# EAGLE schematic drums (EAGLE 7.2.0)
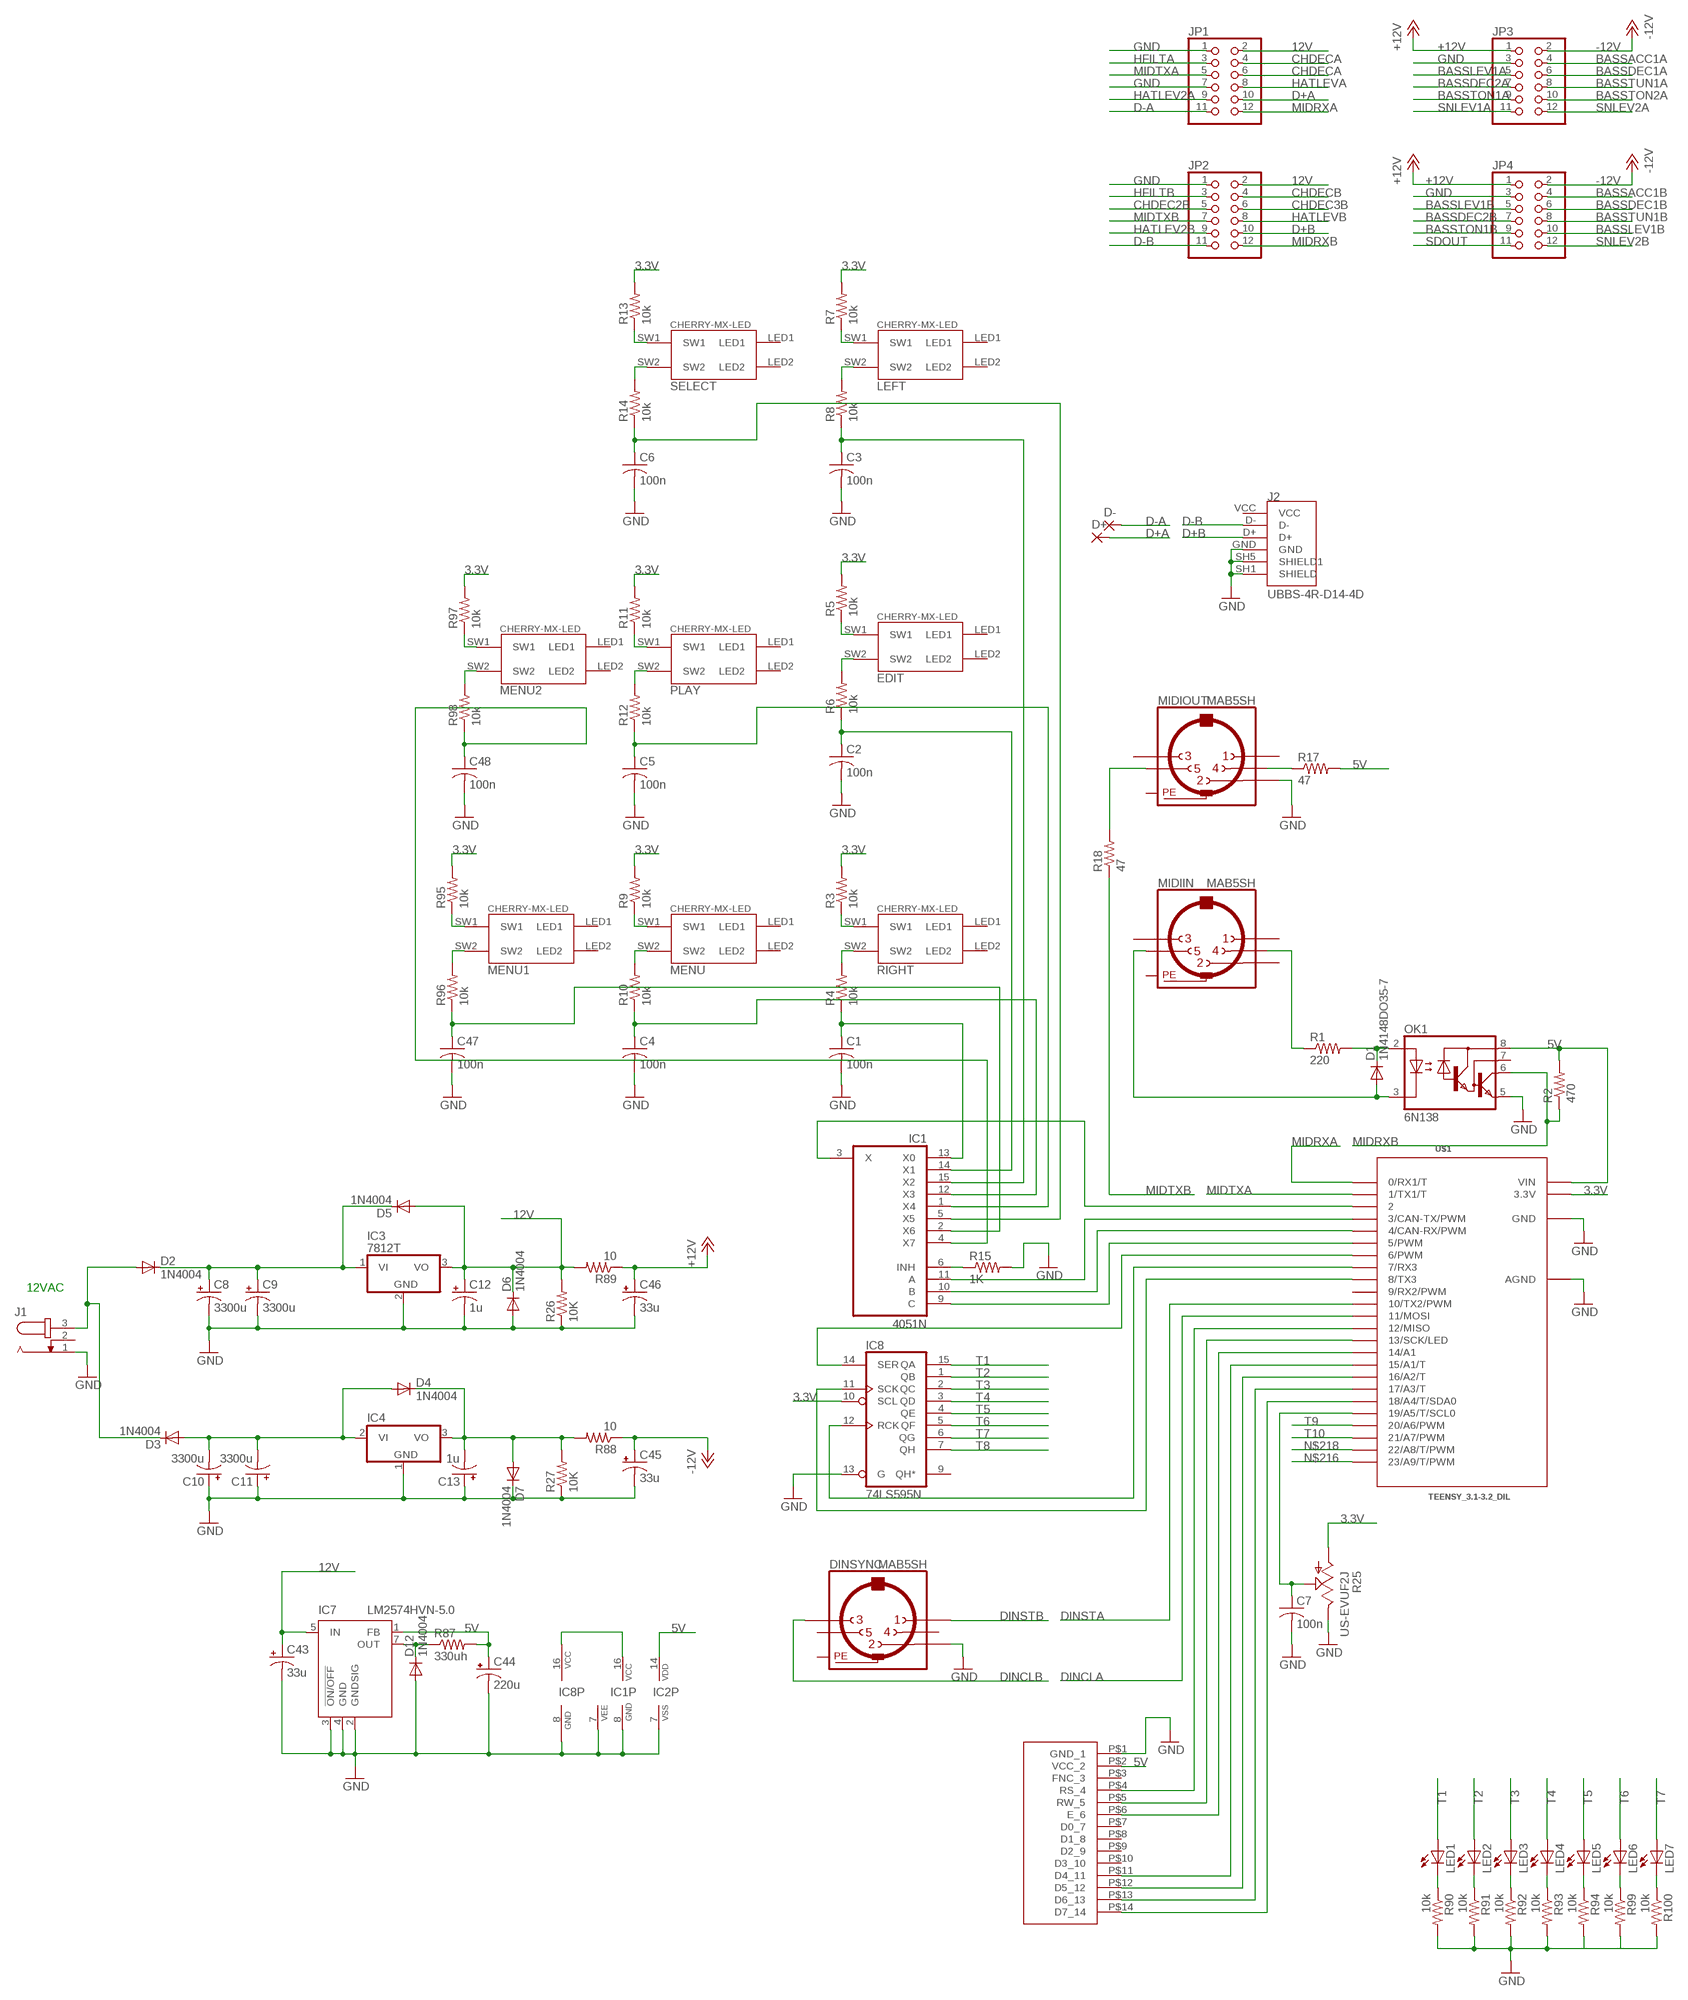
[diagram p0: schematic, sheet 1, part 1 of 2]
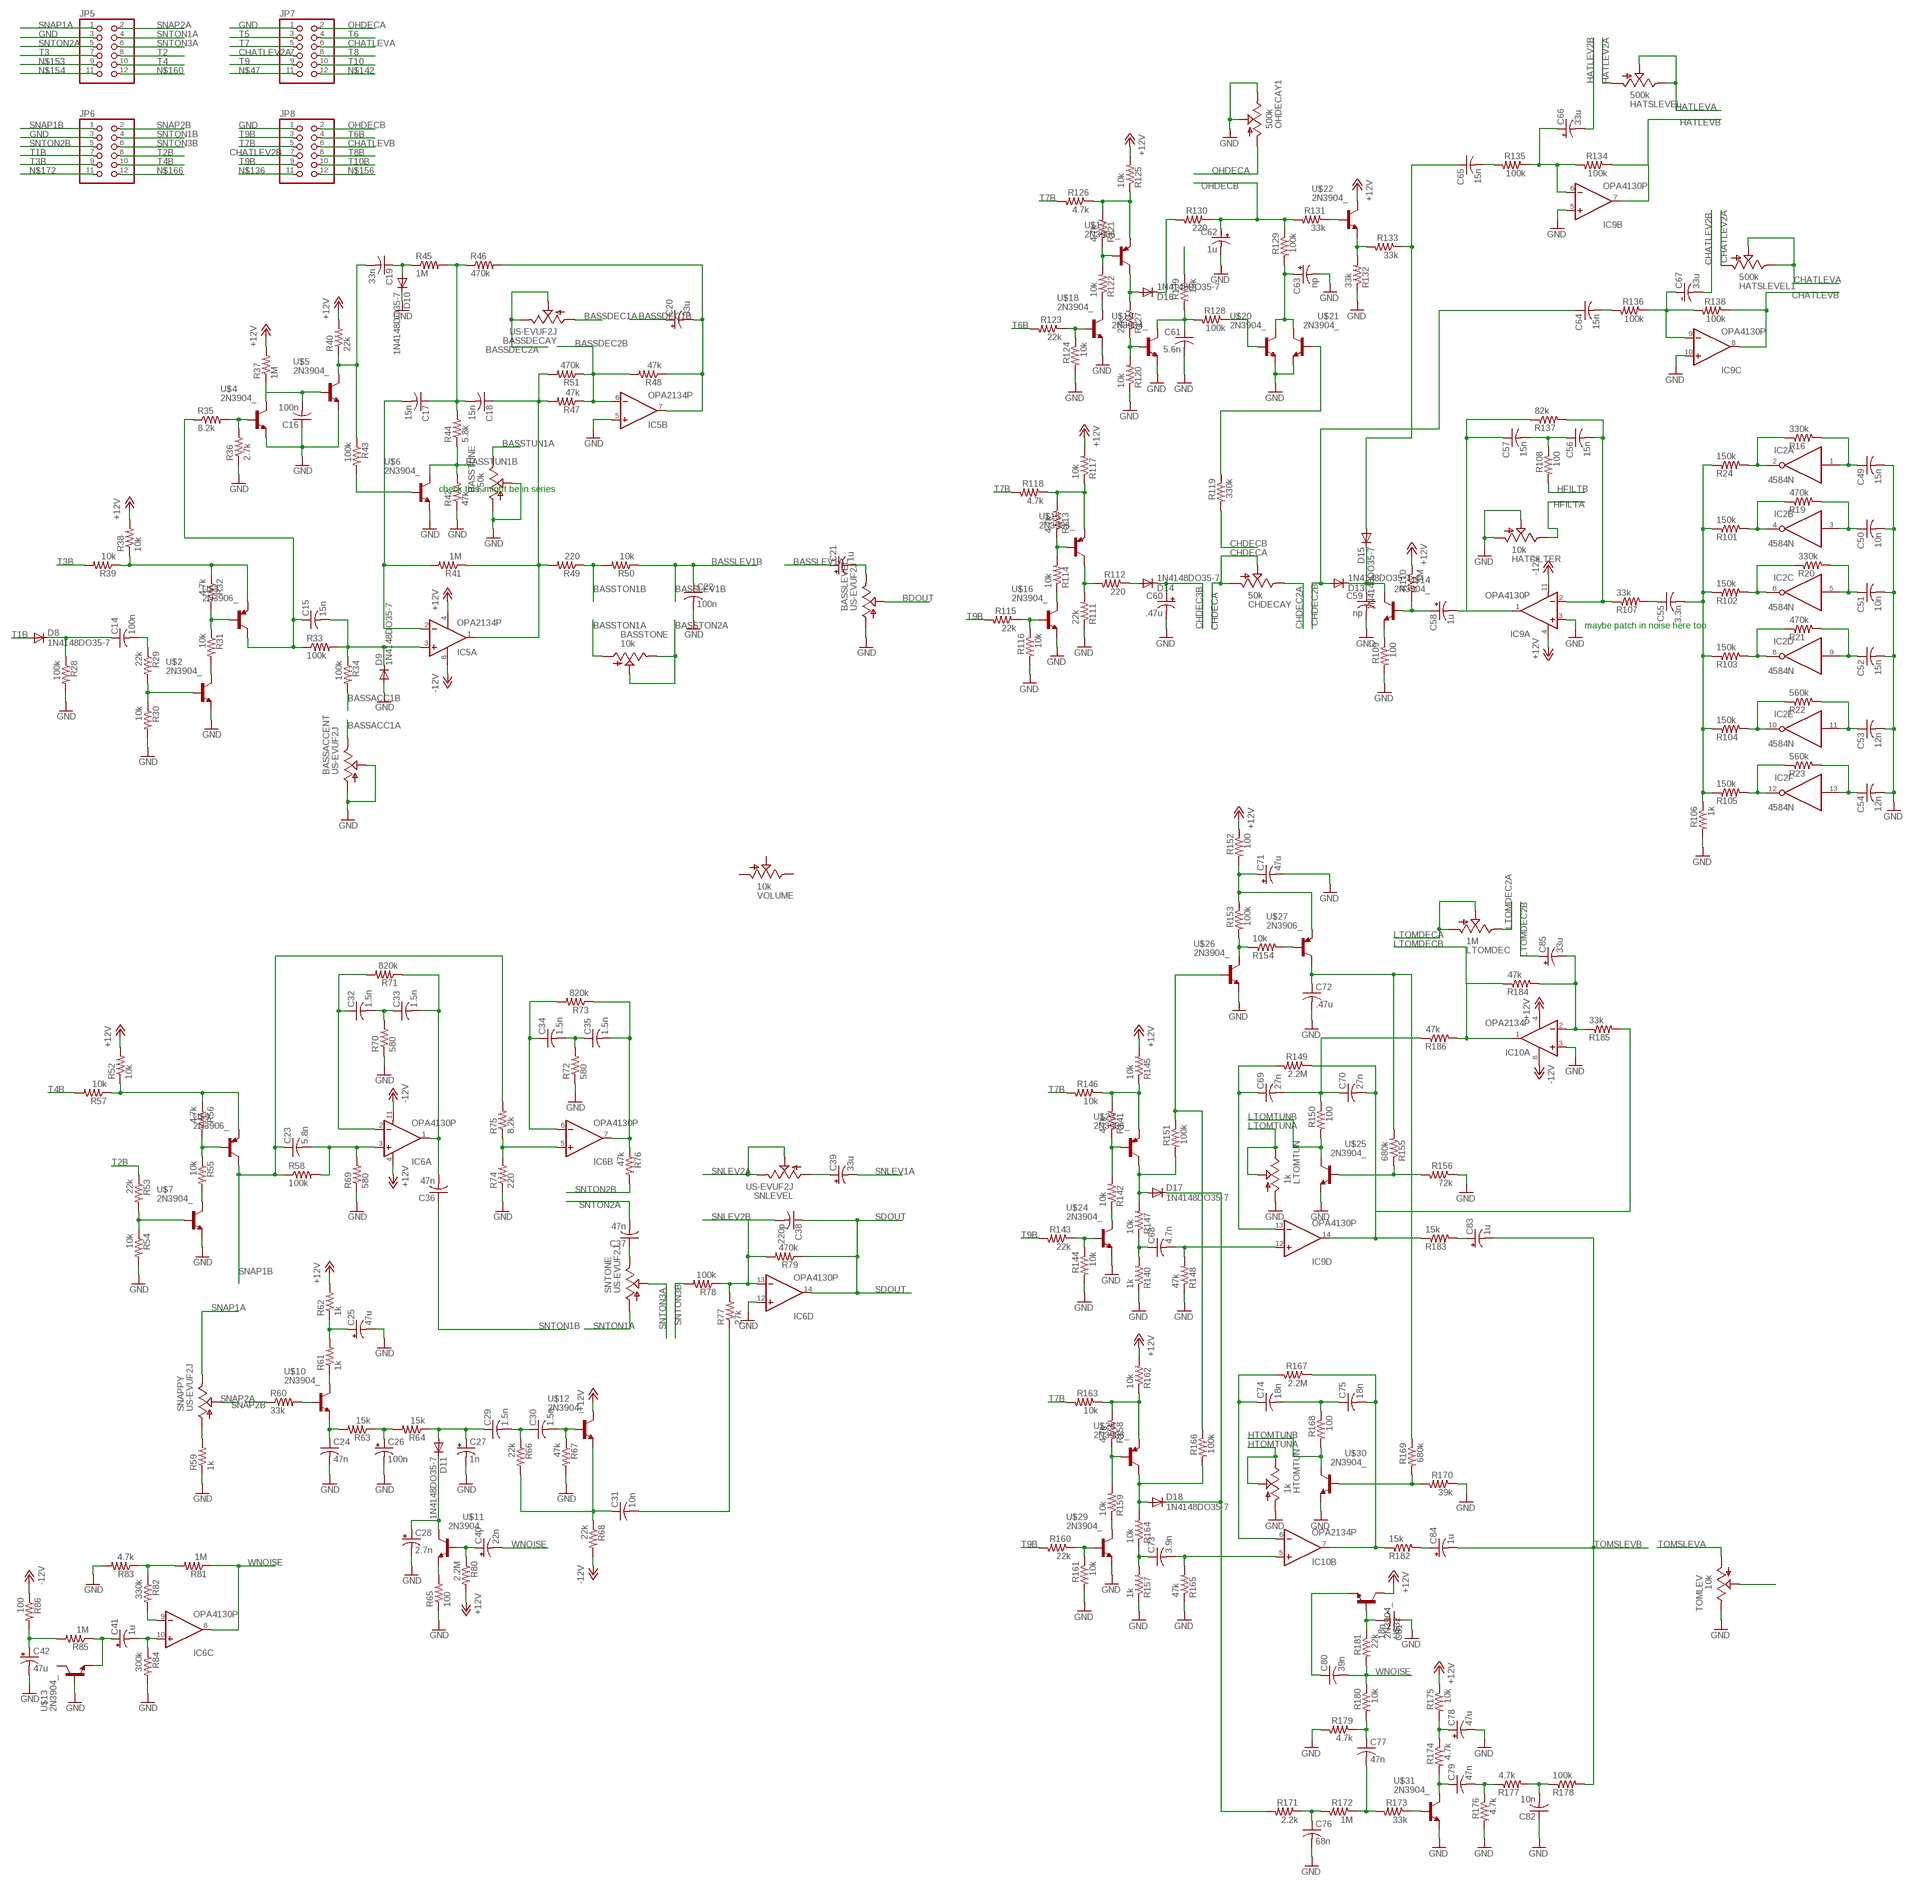
[diagram p1: schematic, sheet 1, part 2 of 2]

## Parts
BASSACCENT  US-EVUF2J  [EVUFXJ]
BASSDECAY  US-EVUF2J  [EVUFXJ]
BASSLEVEL  US-EVUF2J  [EVUFXJ]
BASSTONE  10k  US-EVUF2J  [EVUFXJ]
BASSTUNE  250k  US-EVUF2J  [EVUFXJ]
C1  100n  C-US050-025X075  [C050-025X075]
C2  100n  C-US050-025X075  [C050-025X075]
C3  100n  C-US050-025X075  [C050-025X075]
C4  100n  C-US050-025X075  [C050-025X075]
C5  100n  C-US050-025X075  [C050-025X075]
C6  100n  C-US050-025X075  [C050-025X075]
C7  100n  C-US050-025X075  [C050-025X075]
C8  3300u  CPOL-USE5-10.5  [E5-10,5]
C9  3300u  CPOL-USE5-10.5  [E5-10,5]
C10  3300u  CPOL-USE5-10.5  [E5-10,5]
C11  3300u  CPOL-USE5-10.5  [E5-10,5]
C12  1u  CPOL-USE2-5  [E2-5]
C13  1u  CPOL-USE2-5  [E2-5]
C14  100n  C-US050-025X075  [C050-025X075]
C15  15n  C-US050-025X075  [C050-025X075]
C16  100n  C-US050-025X075  [C050-025X075]
C17  15n  C-US050-025X075  [C050-025X075]
C18  15n  C-US050-025X075  [C050-025X075]
C19  33n  C-US050-025X075  [C050-025X075]
C20  33u  CPOL-USE2-5  [E2-5]
C21  1u  CPOL-USE2-5  [E2-5]
C22  100n  C-US050-025X075  [C050-025X075]
C23  5.8n  C-US050-025X075  [C050-025X075]
C24  47n  C-US050-025X075  [C050-025X075]
C25  47u  CPOL-USE2-5  [E2-5]
C26  100n  CPOL-USE2-5  [E2-5]
C27  1n  CPOL-USE2-5  [E2-5]
C28  2.7n  CPOL-USE2-5  [E2-5]
C29  1.5n  C-US050-025X075  [C050-025X075]
C30  1.5n  C-US050-025X075  [C050-025X075]
C31  10n  C-US050-025X075  [C050-025X075]
C32  1.5n  C-US050-025X075  [C050-025X075]
C33  1.5n  C-US050-025X075  [C050-025X075]
C34  1.5n  C-US050-025X075  [C050-025X075]
C35  1.5n  C-US050-025X075  [C050-025X075]
C36  47n  C-US050-025X075  [C050-025X075]
C37  47n  C-US050-025X075  [C050-025X075]
C38  220p  C-US050-025X075  [C050-025X075]
C39  33u  CPOL-USE2-5  [E2-5]
C40  22n  CPOL-USE2-5  [E2-5]
C41  1u  CPOL-USE2-5  [E2-5]
C42  47u  CPOL-USE2-5  [E2-5]
C43  33u  CPOL-USE2-5  [E2-5]
C44  220u  CPOL-USE2-5  [E2-5]
C45  33u  CPOL-USE2-5  [E2-5]
C46  33u  CPOL-USE2-5  [E2-5]
C47  100n  C-US050-025X075  [C050-025X075]
C48  100n  C-US050-025X075  [C050-025X075]
C49  15n  C-US050-025X075  [C050-025X075]
C50  10n  C-US050-025X075  [C050-025X075]
C51  10n  C-US050-025X075  [C050-025X075]
C52  15n  C-US050-025X075  [C050-025X075]
C53  12n  C-US050-025X075  [C050-025X075]
C54  12n  C-US050-025X075  [C050-025X075]
C55  3.3n  C-US050-025X075  [C050-025X075]
C56  15n  C-US050-025X075  [C050-025X075]
C57  15n  C-US050-025X075  [C050-025X075]
C58  1u  CPOL-USE2-5  [E2-5]
C59  np  C-US050-025X075  [C050-025X075]
C60  .47u  CPOL-USE2-5  [E2-5]
C61  5.6n  C-US050-025X075  [C050-025X075]
C62  1u  CPOL-USE2-5  [E2-5]
C63  np  CPOL-USE2-5  [E2-5]
C64  15n  C-US050-025X075  [C050-025X075]
C65  15n  C-US050-025X075  [C050-025X075]
C66  33u  CPOL-USE2-5  [E2-5]
C67  33u  CPOL-USE2-5  [E2-5]
C68  4.7n  C-US050-025X075  [C050-025X075]
C69  27n  C-US050-025X075  [C050-025X075]
C70  27n  C-US050-025X075  [C050-025X075]
C71  47u  CPOL-USE2-5  [E2-5]
C72  .47u  C-US050-025X075  [C050-025X075]
C73  3.9n  C-US050-025X075  [C050-025X075]
C74  18n  C-US050-025X075  [C050-025X075]
C75  18n  C-US050-025X075  [C050-025X075]
C76  68n  C-US050-025X075  [C050-025X075]
C77  47n  C-US050-025X075  [C050-025X075]
C78  47u  CPOL-USE2-5  [E2-5]
C79  47n  C-US050-025X075  [C050-025X075]
C80  39n  C-US050-025X075  [C050-025X075]
C81  18n  C-US050-025X075  [C050-025X075]
C82  10n  C-US050-025X075  [C050-025X075]
C83  1u  CPOL-USE2-5  [E2-5]
C84  1u  CPOL-USE2-5  [E2-5]
C85  33u  CPOL-USE2-5  [E2-5]
CHDECAY  50k  US-EVUF2J  [EVUFXJ]
D1  1N4148DO35-7  [DO35-7]
D2  1N4004  [DO41-10]
D3  1N4004  [DO41-10]
D4  1N4004  [DO41-10]
D5  1N4004  [DO41-10]
D6  1N4004  [DO41-10]
D7  1N4004  [DO41-10]
D8  1N4148DO35-7  [DO35-7]
D9  1N4148DO35-7  [DO35-7]
D10  1N4148DO35-7  [DO35-7]
D11  1N4148DO35-7  [DO35-7]
D12  1N4004  [DO41-10]
D13  1N4148DO35-7  [DO35-7]
D14  1N4148DO35-7  [DO35-7]
D15  1N4148DO35-7  [DO35-7]
D16  1N4148DO35-7  [DO35-7]
D17  1N4148DO35-7  [DO35-7]
D18  1N4148DO35-7  [DO35-7]
D+  2,0/0,9-R  [2,0/0,9-R]
D-  2,0/0,9-R  [2,0/0,9-R]
DINSYNC  MAB5SH  [MAB5SH]
EDIT  CHERRY-MX-LED  [CHERRY-MX-LED]
HATFILTER  10k  US-EVUF2J  [EVUFXJ]
HATSLEVEL  500k  US-EVUF2J  [EVUFXJ]
HATSLEVEL1  500k  US-EVUF2J  [EVUFXJ]
HTOMTUN  1k  US-EVUF2J  [EVUFXJ]
IC1  4051N  [DIL16]
IC2  4584N  [DIL14]
IC3  7812T  [TO220H]
IC4  7906T  [TO220H]
IC5  OPA2134P  [DIL08]
IC6  OPA4130P  [DIL14]
IC7  LM2574HVN-5.0  [DIL08]
IC8  74LS595N  [DIL16]
IC9  OPA4130P  [DIL14]
IC10  OPA2134P  [DIL08]
J1  JACK-PLUG0  [SPC4077]
J2  UBBS-4R-D14-4D  [JST_UBBS-4R-D14-4D]
JP1  PINHD-2X6  [2X06]
JP2  PINHD-2X6  [2X06]
JP3  PINHD-2X6  [2X06]
JP4  PINHD-2X6  [2X06]
JP5  PINHD-2X6  [2X06]
JP6  PINHD-2X6  [2X06]
JP7  PINHD-2X6  [2X06]
JP8  PINHD-2X6  [2X06]
LED1  LED5MM  [LED5MM]
LED2  LED5MM  [LED5MM]
LED3  LED5MM  [LED5MM]
LED4  LED5MM  [LED5MM]
LED5  LED5MM  [LED5MM]
LED6  LED5MM  [LED5MM]
LED7  LED5MM  [LED5MM]
LEFT  CHERRY-MX-LED  [CHERRY-MX-LED]
LTOMDEC  1M  US-EVUF2J  [EVUFXJ]
LTOMTUN  1k  US-EVUF2J  [EVUFXJ]
MENU  CHERRY-MX-LED  [CHERRY-MX-LED]
MENU1  CHERRY-MX-LED  [CHERRY-MX-LED]
MENU2  CHERRY-MX-LED  [CHERRY-MX-LED]
MIDIIN  MAB5SH  [MAB5SH]
MIDIOUT  MAB5SH  [MAB5SH]
OHDECAY1  500k  US-EVUF2J  [EVUFXJ]
OK1  6N138  [DIL08]
PLAY  CHERRY-MX-LED  [CHERRY-MX-LED]
R1  220  R-US_0207/2V  [0207/2V]
R2  470  R-US_0207/2V  [0207/2V]
R3  10k  R-US_0207/2V  [0207/2V]
R4  10k  R-US_0207/2V  [0207/2V]
R5  10k  R-US_0207/2V  [0207/2V]
R6  10k  R-US_0207/2V  [0207/2V]
R7  10k  R-US_0207/2V  [0207/2V]
R8  10k  R-US_0207/2V  [0207/2V]
R9  10k  R-US_0207/2V  [0207/2V]
R10  10k  R-US_0207/2V  [0207/2V]
R11  10k  R-US_0207/2V  [0207/2V]
R12  10k  R-US_0207/2V  [0207/2V]
R13  10k  R-US_0207/2V  [0207/2V]
R14  10k  R-US_0207/2V  [0207/2V]
R15  1K  R-US_0207/2V  [0207/2V]
R16  330k  R-US_0207/2V  [0207/2V]
R17  47  R-US_0207/2V  [0207/2V]
R18  47  R-US_0207/2V  [0207/2V]
R19  470k  R-US_0207/2V  [0207/2V]
R20  330k  R-US_0207/2V  [0207/2V]
R21  470k  R-US_0207/2V  [0207/2V]
R22  560k  R-US_0207/2V  [0207/2V]
R23  560k  R-US_0207/2V  [0207/2V]
R24  150k  R-US_0207/2V  [0207/2V]
R25  US-EVUF2J  [EVUFXJ]
R26  10K  R-US_0207/7  [0207/7]
R27  10K  R-US_0207/7  [0207/7]
R28  100k  R-US_0207/2V  [0207/2V]
R29  22k  R-US_0207/2V  [0207/2V]
R30  10k  R-US_0207/2V  [0207/2V]
R31  10k  R-US_0207/2V  [0207/2V]
R32  4.7k  R-US_0207/2V  [0207/2V]
R33  100k  R-US_0207/2V  [0207/2V]
R34  100k  R-US_0207/2V  [0207/2V]
R35  8.2k  R-US_0207/2V  [0207/2V]
R36  2.7k  R-US_0207/2V  [0207/2V]
R37  1M  R-US_0207/2V  [0207/2V]
R38  10k  R-US_0207/2V  [0207/2V]
R39  10k  R-US_0207/2V  [0207/2V]
R40  22k  R-US_0207/2V  [0207/2V]
R41  1M  R-US_0207/2V  [0207/2V]
R42  47k  R-US_0207/2V  [0207/2V]
R43  100k  R-US_0207/2V  [0207/2V]
R44  5.8k  R-US_0207/2V  [0207/2V]
R45  1M  R-US_0207/2V  [0207/2V]
R46  470k  R-US_0207/2V  [0207/2V]
R47  47k  R-US_0207/2V  [0207/2V]
R48  47k  R-US_0207/2V  [0207/2V]
R49  220  R-US_0207/2V  [0207/2V]
R50  10k  R-US_0207/2V  [0207/2V]
R51  470k  R-US_0207/2V  [0207/2V]
R52  10k  R-US_0207/2V  [0207/2V]
R53  22k  R-US_0207/2V  [0207/2V]
R54  10k  R-US_0207/2V  [0207/2V]
R55  10k  R-US_0207/2V  [0207/2V]
R56  4.7k  R-US_0207/2V  [0207/2V]
R57  10k  R-US_0207/2V  [0207/2V]
R58  100k  R-US_0207/2V  [0207/2V]
R59  1k  R-US_0207/2V  [0207/2V]
R60  33k  R-US_0207/2V  [0207/2V]
R61  1k  R-US_0207/2V  [0207/2V]
R62  1k  R-US_0207/2V  [0207/2V]
R63  15k  R-US_0207/2V  [0207/2V]
R64  15k  R-US_0207/2V  [0207/2V]
R65  100  R-US_0207/2V  [0207/2V]
R66  22k  R-US_0207/2V  [0207/2V]
R67  47k  R-US_0207/2V  [0207/2V]
R68  22k  R-US_0207/2V  [0207/2V]
R69  580  R-US_0207/2V  [0207/2V]
R70  580  R-US_0207/2V  [0207/2V]
R71  820k  R-US_0207/2V  [0207/2V]
R72  580  R-US_0207/2V  [0207/2V]
R73  820k  R-US_0207/2V  [0207/2V]
R74  220  R-US_0207/2V  [0207/2V]
R75  8.2k  R-US_0207/2V  [0207/2V]
R76  47k  R-US_0207/2V  [0207/2V]
R77  27k  R-US_0207/2V  [0207/2V]
R78  100k  R-US_0207/2V  [0207/2V]
R79  470k  R-US_0207/2V  [0207/2V]
R80  2.2M  R-US_0207/2V  [0207/2V]
R81  1M  R-US_0207/2V  [0207/2V]
R82  330k  R-US_0207/2V  [0207/2V]
R83  4.7k  R-US_0207/2V  [0207/2V]
R84  300k  R-US_0207/2V  [0207/2V]
R85  1M  R-US_0207/2V  [0207/2V]
R86  100  R-US_0207/2V  [0207/2V]
R87  330uh  R-US_0207/2V  [0207/2V]
R88  10  R-US_0207/7  [0207/7]
R89  10  R-US_0207/7  [0207/7]
R90  10k  R-US_0207/2V  [0207/2V]
R91  10k  R-US_0207/2V  [0207/2V]
R92  10k  R-US_0207/2V  [0207/2V]
R93  10k  R-US_0207/2V  [0207/2V]
R94  10k  R-US_0207/2V  [0207/2V]
R95  10k  R-US_0207/2V  [0207/2V]
R96  10k  R-US_0207/2V  [0207/2V]
R97  10k  R-US_0207/2V  [0207/2V]
R98  10k  R-US_0207/2V  [0207/2V]
R99  10k  R-US_0207/2V  [0207/2V]
R100  10k  R-US_0207/2V  [0207/2V]
R101  150k  R-US_0207/2V  [0207/2V]
R102  150k  R-US_0207/2V  [0207/2V]
R103  150k  R-US_0207/2V  [0207/2V]
R104  150k  R-US_0207/2V  [0207/2V]
R105  150k  R-US_0207/2V  [0207/2V]
R106  1k  R-US_0207/2V  [0207/2V]
R107  33k  R-US_0207/2V  [0207/2V]
R108  100  R-US_0207/2V  [0207/2V]
R109  100  R-US_0207/2V  [0207/2V]
R110  1M  R-US_0207/2V  [0207/2V]
R111  22k  R-US_0207/2V  [0207/2V]
R112  220  R-US_0207/2V  [0207/2V]
R113  4.7k  R-US_0207/2V  [0207/2V]
R114  10k  R-US_0207/2V  [0207/2V]
R115  22k  R-US_0207/2V  [0207/2V]
R116  10k  R-US_0207/2V  [0207/2V]
R117  10k  R-US_0207/2V  [0207/2V]
R118  4.7k  R-US_0207/2V  [0207/2V]
R119  330k  R-US_0207/2V  [0207/2V]
R120  10k  R-US_0207/2V  [0207/2V]
R121  4.7k  R-US_0207/2V  [0207/2V]
R122  10k  R-US_0207/2V  [0207/2V]
R123  22k  R-US_0207/2V  [0207/2V]
R124  10k  R-US_0207/2V  [0207/2V]
R125  10k  R-US_0207/2V  [0207/2V]
R126  4.7k  R-US_0207/2V  [0207/2V]
R127  22k  R-US_0207/2V  [0207/2V]
R128  100k  R-US_0207/2V  [0207/2V]
R129  100k  R-US_0207/2V  [0207/2V]
R130  220  R-US_0207/2V  [0207/2V]
R131  33k  R-US_0207/2V  [0207/2V]
R132  33k  R-US_0207/2V  [0207/2V]
R133  33k  R-US_0207/2V  [0207/2V]
R134  100k  R-US_0207/2V  [0207/2V]
R135  100k  R-US_0207/2V  [0207/2V]
R136  100k  R-US_0207/2V  [0207/2V]
R137  82k  R-US_0207/2V  [0207/2V]
R138  100k  R-US_0207/2V  [0207/2V]
R139  15k  R-US_0207/2V  [0207/2V]
R140  1k  R-US_0207/2V  [0207/2V]
R141  4.7k  R-US_0207/2V  [0207/2V]
R142  10k  R-US_0207/2V  [0207/2V]
R143  22k  R-US_0207/2V  [0207/2V]
R144  10k  R-US_0207/2V  [0207/2V]
R145  10k  R-US_0207/2V  [0207/2V]
R146  10k  R-US_0207/2V  [0207/2V]
R147  10k  R-US_0207/2V  [0207/2V]
R148  47k  R-US_0207/2V  [0207/2V]
R149  2.2M  R-US_0207/2V  [0207/2V]
R150  100  R-US_0207/2V  [0207/2V]
R151  100k  R-US_0207/2V  [0207/2V]
R152  100  R-US_0207/2V  [0207/2V]
R153  100k  R-US_0207/2V  [0207/2V]
R154  10k  R-US_0207/2V  [0207/2V]
R155  680k  R-US_0207/2V  [0207/2V]
R156  72k  R-US_0207/2V  [0207/2V]
R157  1k  R-US_0207/2V  [0207/2V]
R158  4.7k  R-US_0207/2V  [0207/2V]
R159  10k  R-US_0207/2V  [0207/2V]
R160  22k  R-US_0207/2V  [0207/2V]
R161  10k  R-US_0207/2V  [0207/2V]
R162  10k  R-US_0207/2V  [0207/2V]
R163  10k  R-US_0207/2V  [0207/2V]
R164  10k  R-US_0207/2V  [0207/2V]
R165  47k  R-US_0207/2V  [0207/2V]
R166  100k  R-US_0207/2V  [0207/2V]
R167  2.2M  R-US_0207/2V  [0207/2V]
R168  100  R-US_0207/2V  [0207/2V]
R169  680k  R-US_0207/2V  [0207/2V]
R170  39k  R-US_0207/2V  [0207/2V]
R171  2.2k  R-US_0207/2V  [0207/2V]
R172  1M  R-US_0207/2V  [0207/2V]
R173  33k  R-US_0207/2V  [0207/2V]
R174  4.7k  R-US_0207/2V  [0207/2V]
R175  10k  R-US_0207/2V  [0207/2V]
R176  4.7k  R-US_0207/2V  [0207/2V]
R177  4.7k  R-US_0207/2V  [0207/2V]
R178  100k  R-US_0207/2V  [0207/2V]
R179  4.7k  R-US_0207/2V  [0207/2V]
R180  10k  R-US_0207/2V  [0207/2V]
R181  22k  R-US_0207/2V  [0207/2V]
R182  15k  R-US_0207/2V  [0207/2V]
R183  15k  R-US_0207/2V  [0207/2V]
R184  47k  R-US_0207/2V  [0207/2V]
R185  33k  R-US_0207/2V  [0207/2V]
R186  47k  R-US_0207/2V  [0207/2V]
RIGHT  CHERRY-MX-LED  [CHERRY-MX-LED]
SELECT  CHERRY-MX-LED  [CHERRY-MX-LED]
SNAPPY  US-EVUF2J  [EVUFXJ]
SNLEVEL  US-EVUF2J  [EVUFXJ]
SNTONE  US-EVUF2J  [EVUFXJ]
TOMLEV  10k  US-EVUF2J  [EVUFXJ]
U$1  TEENSY_3.1-3.2_DIL  [TEENSY_3.0-3.2&LC_DIL]
U$2  2N3904_  [TO92-EBC]
U$3  2N3906_  [TO92-EBC]
U$4  2N3904_  [TO92-EBC]
U$5  2N3904_  [TO92-EBC]
U$6  2N3904_  [TO92-EBC]
U$7  2N3904_  [TO92-EBC]
U$8  CU20045-UW  [CU20045-UW]
U$9  2N3906_  [TO92-EBC]
U$10  2N3904_  [TO92-EBC]
U$11  2N3904_  [TO92-EBC]
U$12  2N3904_  [TO92-EBC]
U$13  2N3904_  [TO92-EBC]
U$14  2N3904_  [TO92-EBC]
U$15  2N3906_  [TO92-EBC]
U$16  2N3904_  [TO92-EBC]
U$17  2N3906_  [TO92-EBC]
U$18  2N3904_  [TO92-EBC]
U$19  2N3904_  [TO92-EBC]
U$20  2N3904_  [TO92-EBC]
U$21  2N3904_  [TO92-EBC]
U$22  2N3904_  [TO92-EBC]
U$23  2N3906_  [TO92-EBC]
U$24  2N3904_  [TO92-EBC]
U$25  2N3904_  [TO92-EBC]
U$26  2N3904_  [TO92-EBC]
U$27  2N3906_  [TO92-EBC]
U$28  2N3906_  [TO92-EBC]
U$29  2N3904_  [TO92-EBC]
U$30  2N3904_  [TO92-EBC]
U$31  2N3904_  [TO92-EBC]
U$32  2N3904_  [TO92-EBC]
VOLUME  10k  US-EVUF2J  [EVUFXJ]

## Nets
3.3V: IC1.16(VCC) IC8.10(SCL) IC8.16(VCC) R3.2 R5.2 R7.2 R9.2 R11.2 R13.2 R25.1(A) R95.2 R97.2 U$1.3.3V
5V: C44.+ IC2.14(P:VDD) IC7.1(FB) OK1.8(VCC) R2.2 R17.2 R87.2 U$1.VIN U$8.P$2(VCC_2)
12V: C12.+ C43.+ D5.A D6.C IC3.3(VO) IC7.5(IN) JP1.2 JP2.2 R26.2 R89.2
+12V: C46.+ IC5.4(P:V-) IC6.4(A:V+) IC9.4(A:V+) IC10.4(P:V-) JP3.1 JP4.1 R37.2 R38.2 R40.2 R52.2 R62.2 R80.2 R89.1 R110.1 R117.2 R125.2 R145.2 R152.1 R162.2 R175.1 U$12.E(C) U$22.E(C) U$32.E(C)
-12V: C45.+ IC5.8(P:V+) IC6.11(A:V-) IC9.11(A:V-) IC10.8(P:V+) JP3.2 JP4.2 R68.2 R86.1 R88.1
BASSACC1A: BASSACCENT.3(E) JP3.4
BASSACC1B: JP4.4 R34.2
BASSDEC1A: BASSDECAY.1(A) JP3.6
BASSDEC1B: C20.+ JP4.6
BASSDEC2A: BASSDECAY.2(S) BASSDECAY.3(E) JP3.7
BASSDEC2B: IC5.6(B:-IN) JP4.7 R47.1 R48.2 R51.1
BASSLEV1A: C21.+ JP3.5
BASSLEV1B: C22.1 JP4.5 JP4.10 R50.1
BASSTON1A: BASSTONE.1(A) JP3.9
BASSTON1B: JP4.9 R49.1 R50.2
BASSTON2A: BASSTONE.2(S) BASSTONE.3(E) JP3.10
BASSTUN1A: BASSTUNE.3(E) JP3.8
BASSTUN1B: JP4.8 R42.2 R44.1 U$6.E(C)
BDOUT: BASSLEVEL.2(S)
CHATLEV2A: HATSLEVEL1.1(A) JP7.7
CHATLEV2B: C67.- JP8.7
CHATLEVA: HATSLEVEL1.2(S) HATSLEVEL1.3(E) JP7.6
CHATLEVB: IC9.8(C:OUT) JP8.6 R138.1
CHDEC2A: CHDECAY.3(E)
CHDEC2B: C64.1 D13.A JP2.5
CHDEC3B: C60.+ D14.C JP2.6
CHDECA: CHDECAY.1(A) CHDECAY.2(S) JP1.4 JP1.6
CHDECB: JP2.4 R119.2
D+A: D+.1(P) JP1.10
D+B: J2.D+ JP2.10
D-A: D-.1(P) JP1.11
D-B: J2.D- JP2.11
DINCLA: U$1.11(11/MOSI)
DINCLB: DINSYNC.3
DINSTA: U$1.10(10/TX2/PWM)
DINSTB: DINSYNC.1
GND: BASSACCENT.1(A) BASSACCENT.2(S) BASSLEVEL.1(A) BASSTUNE.1(A) BASSTUNE.2(S) C1.2 C2.2 C3.2 C4.2 C5.2 C6.2 C7.2 C8.- C9.- C10.+ C11.+ C12.- C13.+ C16.1 C22.2 C24.2 C25.- C26.- C27.- C28.- C42.- C43.- C44.- C45.- C46.- C47.2 C48.2 C49.2 C50.2 C51.2 C52.2 C53.2 C54.2 C59.2 C60.- C61.2 C62.- C63.- C71.- C72.2 C76.2 C78.- C81.1 C82.1 D6.A D7.C D9.A D10.C D12.A DINSYNC.2 HATFILTER.1(A) HATFILTER.2(S) HTOMTUN.1(A) IC1.7(VEE) IC1.8(GND) IC2.7(P:VSS) IC3.2(GND) IC4.1(GND) IC5.5(B:+IN) IC6.12(D:+IN) IC7.2(GNDSIG) IC7.3(!ON/OFF) IC7.4(GND) IC8.8(GND) IC8.13(G) IC9.3(A:+IN) IC9.5(B:+IN) IC9.10(C:+IN) IC10.3(A:+IN) J1.1 J2.GND J2.SH1(SHIELD) J2.SH5(SHIELD1) JP1.1 JP1.7 JP2.1 JP3.3 JP4.3 JP5.3 JP6.3 JP7.1 JP8.1 LTOMTUN.1(A) MIDIOUT.2 OHDECAY1.2(S) OHDECAY1.3(E) OK1.5(GND) R15.2 R25.3(E) R26.1 R27.1 R28.2 R30.2 R36.1 R42.1 R54.2 R59.1 R65.1 R67.2 R69.1 R70.1 R72.1 R74.1 R83.2 R84.2 R90.2 R91.2 R92.2 R93.2 R94.2 R106.2 R109.2 R111.1 R116.2 R120.1 R124.2 R132.1 R140.1 R144.2 R148.1 R156.1 R157.1 R161.2 R165.1 R170.1 R176.2 R179.2 TOMLEV.3(E) U$1.AGND U$1.GND U$2.C(E) U$4.C(E) U$5.C(E) U$6.C(E) U$7.C(E) U$8.P$1(GND_1) U$13.B U$16.C(E) U$18.C(E) U$19.C(E) U$20.C(E) U$21.C(E) U$24.C(E) U$25.C(E) U$26.C(E) U$29.C(E) U$30.C(E) U$31.C(E)
GND1: R99.2
GND2: R100.2
HATLEV2A: HATSLEVEL.1(A) JP1.9
HATLEV2B: C66.- JP2.9
HATLEVA: HATSLEVEL.2(S) HATSLEVEL.3(E) JP1.8
HATLEVB: IC9.7(B:OUT) JP2.8 R134.1
HFILTA: HATFILTER.3(E) JP1.3
HFILTB: JP2.3 R108.2
HTOMTUNA: HTOMTUN.2(S) HTOMTUN.3(E)
HTOMTUNB: R168.2 U$30.E(C)
LTOMDEC2A: LTOMDEC.3(E)
LTOMDEC2B: C85.+
LTOMDECA: LTOMDEC.1(A) LTOMDEC.2(S)
LTOMDECB: IC10.1(A:OUT) R184.1 R186.2
LTOMTUNA: LTOMTUN.2(S) LTOMTUN.3(E)
LTOMTUNB: R150.2 U$25.E(C)
MIDRXA: JP1.12 U$1.0(0/RX1/T)
MIDRXB: JP2.12 OK1.6(VO) R2.1
MIDTXA: JP1.5 U$1.1(1/TX1/T)
MIDTXB: JP2.7 R18.1
N$1: R4.2 RIGHT.SW2
N$2: C67.+ IC9.9(C:-IN) R136.1 R138.2
N$3: C1.1 IC1.13(X0) R4.1
N$4: D1.C OK1.2(A) R1.2
N$5: D1.A MIDIIN.5 OK1.3(C)
N$6: EDIT.SW1 R5.1
N$7: IC1.3(X) U$1.2
N$8: IC1.11(A) U$1.3(3/CAN-TX/PWM)
N$9: IC1.10(B) U$1.4(4/CAN-RX/PWM)
N$10: IC1.9(C) U$1.5(5/PWM)
N$11: R3.1 RIGHT.SW1
N$12: EDIT.SW2 R6.2
N$13: C2.1 IC1.14(X1) R6.1
N$14: LEFT.SW1 R7.1
N$15: LEFT.SW2 R8.2
N$16: C3.1 IC1.15(X2) R8.1
N$17: MENU.SW1 R9.1
N$18: MENU.SW2 R10.2
N$19: C4.1 IC1.12(X3) R10.1
N$20: PLAY.SW1 R11.1
N$21: PLAY.SW2 R12.2
N$22: C5.1 IC1.1(X4) R12.1
N$23: R13.1 SELECT.SW1
N$24: R14.2 SELECT.SW2
N$25: C6.1 IC1.5(X5) R14.1
N$26: MIDIIN.4 R1.1
N$27: IC1.6(INH) R15.1
N$28: IC8.12(RCK) U$1.7(7/RX3)
N$29: IC8.14(SER) U$1.6(6/PWM)
N$30: IC8.11(SCK) U$1.8(8/TX3)
N$31: C52.1 IC2.9(D:I) R21.2
N$32: R139.1
N$33: MIDIOUT.4 R17.1
N$34: MIDIOUT.5 R18.2
N$35: D17.A R147.2 R151.2 U$23.E(C)
N$36: R141.1 R142.2 U$23.B
N$37: R141.2 R145.1 R146.1 U$23.C(E)
N$38: R142.1 U$24.E(C)
N$40: U$1.12(12/MISO) U$8.P$4(RS_4)
N$41: U$1.13(13/SCK/LED) U$8.P$5(RW_5)
N$42: U$1.14/A0(14/A1) U$8.P$6(E_6)
N$43: U$1.15/A1(15/A1/T) U$8.P$11(D4_11)
N$44: U$1.16/A2(16/A2/T) U$8.P$12(D5_12)
N$45: U$1.17/A3(17/A3/T) U$8.P$13(D6_13)
N$46: U$1.18/A4(18/A4/T/SDA0) U$8.P$14(D7_14)
N$47: JP7.11
N$48: R143.1 R144.1 U$24.B
N$49: IC2.8(D:O) R21.1 R103.2
N$50: C68.1 R140.2 R147.1
N$51: C7.1 R25.2(S) U$1.19/A5(19/A5/T/SCL0)
N$52: C8.+ C9.+ D2.C D5.C IC3.1(VI)
N$53: C10.- C11.- D3.A D4.A IC4.2(VI)
N$54: D2.A D3.C J1.3
N$55: C14.1 D8.C R28.1
N$56: C14.2 R29.1
N$57: R29.2 R30.1 U$2.B
N$58: R31.2 U$2.E(C)
N$59: R31.1 R32.2 U$3.B
N$60: R32.1 R38.1 R39.1 U$3.C(E)
N$61: C15.1 R33.1 R35.1 U$3.E(C)
N$62: C17.2 IC5.2(A:-IN) R41.2
N$63: C15.2 D9.C IC5.3(A:+IN) R33.2 R34.1
N$64: C19.2 R40.1 R43.1 U$5.E(C)
N$65: C18.1 IC5.1(A:OUT) R41.1 R47.2 R49.2 R51.2
N$66: R35.2 R36.2 U$4.B
N$67: IC2.2(A:O) R16.1 R24.2
N$68: C16.2 R37.1 U$4.E(C) U$5.B
N$69: C23.2 IC6.3(A:+IN) R58.2 R69.2
N$70: R43.2 U$6.B
N$71: C49.1 IC2.1(A:I) R16.2
N$72: C17.1 C18.2 R44.2 R45.2 R46.1
N$73: C19.1 D10.A R45.1
N$74: C50.1 IC2.3(B:I) R19.2
N$75: IC2.4(B:O) R19.1 R101.2
N$76: BASSLEVEL.3(E) C21.-
N$77: C20.- IC5.7(B:OUT) R46.2 R48.1
N$78: R59.2 SNAPPY.1(A)
N$79: IC2.6(C:O) R20.1 R102.2
N$80: C51.1 IC2.5(C:I) R20.2
N$81: R53.2 R54.1 U$7.B
N$82: R55.2 U$7.E(C)
N$83: R55.1 R56.2 U$9.B
N$84: R52.1 R56.1 R57.1 U$9.C(E)
N$85: C53.1 IC2.11(E:I) R22.2
N$86: IC2.10(E:O) R22.1 R104.2
N$87: R60.2 U$10.B
N$88: R61.1 U$10.E(C)
N$89: C25.+ R61.2 R62.1
N$90: C24.1 R63.2 U$10.C(E)
N$91: C26.+ R63.1 R64.2
N$92: C27.+ C29.1 D11.A R64.1
N$93: R65.2 U$11.C(E)
N$94: C29.2 C30.1 R66.1
N$95: C28.+ D11.C U$11.E(C)
N$96: C30.2 R67.1 U$12.B
N$97: C31.1 R66.2 R68.1 U$12.C(E)
N$98: C32.2 C33.1 R70.2
N$99: C33.2 C36.2 IC6.1(A:OUT) R71.1
N$100: C32.1 IC6.2(A:-IN) R71.2
N$101: C34.2 C35.1 R72.2
N$102: C35.2 IC6.7(B:OUT) R73.1 R76.1
N$103: C34.1 IC6.6(B:-IN) R73.2
N$104: IC6.5(B:+IN) R74.2 R75.1
N$105: C37.1 SNTONE.3(E)
N$106: IC2.12(F:O) R23.1 R105.2
N$107: C54.1 IC2.13(F:I) R23.2
N$108: C31.2 R77.1
N$109: C58.+ R110.2 U$14.B
N$110: C55.2 R24.1 R101.1 R102.1 R103.1 R104.1 R105.1 R106.1
N$111: LED1.K(C) R90.1
N$112: C40.+ R80.1 U$11.B
N$113: IC6.9(C:-IN) R82.2
N$114: C39.+ SNLEVEL.1(A)
N$115: LED2.K(C) R91.1
N$116: R81.2 R82.1 R83.1
N$117: C41.- IC6.10(C:+IN) R84.1
N$118: C41.+ R85.1 U$13.C(E)
N$119: C42.+ R85.2 R86.2
N$120: D12.C IC7.7(OUT) R87.1
N$121: C13.- D4.C D7.A IC4.3(VO) R27.2 R88.2
N$122: LED3.K(C) R92.1
N$123: LED4.K(C) R93.1
N$124: LED5.K(C) R94.1
N$125: MENU1.SW1 R95.1
N$126: MENU1.SW2 R96.2
N$127: C47.1 IC1.2(X6) R96.1
N$128: MENU2.SW1 R97.1
N$129: MENU2.SW2 R98.2
N$130: C48.1 IC1.4(X7) R98.1
N$131: LED7.K(C) R100.1
N$132: C68.2 IC9.12(D:+IN) R148.2
N$133: LED6.K(C) R99.1
N$134: C69.1 IC9.13(D:-IN) R149.2
N$136: JP8.11
N$137: C70.2 IC9.14(D:OUT) R149.1 R183.1 R185.2
N$138: C69.2 C70.1 R150.1 R186.1
N$142: JP7.12
N$143: C55.1 R107.2
N$144: C71.+ R152.2 R153.1 U$27.C(E)
N$145: C76.1 R171.1 R172.2
N$146: R153.2 R154.1 U$26.E(C)
N$149: C56.2 IC9.2(A:-IN) R107.1 R137.2
N$150: C56.1 C57.2 R108.1
N$151: C57.1 C58.- IC9.1(A:OUT) R137.1
N$152: R109.1 U$14.C(E)
N$153: JP5.9
N$154: JP5.11
N$155: C59.1 D13.C D15.C U$14.E(C)
N$156: JP8.12
N$157: C72.1 R155.2 R169.1 U$27.E(C)
N$158: D14.A R112.1
N$159: R113.1 R114.2 U$15.B
N$160: JP5.12
N$161: R111.2 R112.2 U$15.E(C)
N$162: R113.2 R117.1 R118.1 U$15.C(E)
N$163: R114.1 U$16.E(C)
N$164: R115.1 R116.1 U$16.B
N$165: R154.2 U$27.B
N$166: JP6.12
N$167: R155.1 R156.2 U$25.B
N$168: D16.A R127.2 U$17.E(C)
N$169: R121.1 R122.2 U$17.B
N$170: R121.2 R125.1 R126.1 U$17.C(E)
N$171: R122.1 U$18.E(C)
N$172: JP6.11
N$173: R123.1 R124.1 U$18.B
N$174: C77.2 R172.1 R173.2
N$175: D18.A R164.2 R166.2 U$28.E(C)
N$176: R120.2 R127.1 U$19.B
N$177: C61.1 R128.2 R139.2 U$19.E(C)
N$178: C65.1 D15.A R133.1
N$179: R128.1 U$20.B
N$180: C63.+ R129.2 U$20.E(C) U$21.E(C)
N$181: D16.C R130.2
N$182: R158.1 R159.2 U$28.B
N$183: R131.1 U$22.B
N$184: R132.2 R133.2 U$22.C(E)
N$185: R119.1 U$21.B
N$186: R158.2 R162.1 R163.1 U$28.C(E)
N$187: C64.2 R136.2
N$188: C65.2 R135.2
N$189: C66.+ IC9.6(B:-IN) R134.2 R135.1
N$190: R159.1 U$29.E(C)
N$191: R160.1 R161.1 U$29.B
N$192: C73.1 R157.2 R164.1
N$193: C73.2 IC10.5(B:+IN) R165.2
N$194: R151.1 R166.1 U$26.B
N$195: D17.C D18.C R171.2
N$196: R173.1 U$31.B
N$197: C74.1 IC10.6(B:-IN) R167.2
N$198: C75.2 IC10.7(B:OUT) R167.1 R182.1
N$199: C74.2 C75.1 R168.1
N$201: R169.2 R170.2 U$30.B
N$202: C79.1 R174.2 U$31.E(C)
N$203: C78.+ R174.1 R175.2
N$204: C77.1 R179.1 R180.2
N$205: C81.2 R181.1 U$32.B
N$206: C79.2 R176.1 R177.1
N$207: C80.1 U$32.C(E)
N$208: C82.2 R177.2 R178.1
N$209: C85.- IC10.2(A:-IN) R184.2 R185.1
N$210: C84.+ R182.2
N$211: C83.+ R183.2
N$215: TOMLEV.2(S)
N$216: U$1.23/A9(23/A9/T/PWM)
N$218: U$1.22/A8(22/A8/T/PWM)
OHDECA: JP7.2 OHDECAY1.1(A)
OHDECB: C62.+ JP8.2 R129.1 R130.1 R131.2
SDOUT: C38.1 IC6.14(D:OUT) JP4.11 R79.1
SNAP1A: JP5.1 SNAPPY.3(E)
SNAP1B: C23.1 JP6.1 R58.1 R75.2 U$9.E(C)
SNAP2A: JP5.2 SNAPPY.2(S)
SNAP2B: JP6.2 R60.1
SNLEV1A: C39.- JP3.11
SNLEV2A: JP3.12 SNLEVEL.2(S) SNLEVEL.3(E)
SNLEV2B: C38.2 IC6.13(D:-IN) JP4.12 R77.2 R78.1 R79.2
SNTON1A: JP5.4 SNTONE.1(A)
SNTON1B: C36.1 JP6.4
SNTON2A: C37.2 JP5.5
SNTON2B: JP6.5 R76.2
SNTON3A: JP5.6 SNTONE.2(S)
SNTON3B: JP6.6 R78.2
T1: IC8.15(QA) LED1.A
T1B: D8.A JP6.7
T2: IC8.1(QB) JP5.8 LED2.A
T2B: JP6.8 R53.1
T3: IC8.2(QC) JP5.7 LED3.A
T3B: JP6.9 R39.2
T4: IC8.3(QD) JP5.10 LED4.A
T4B: JP6.10 R57.2
T5: IC8.4(QE) JP7.3 LED5.A
T6: IC8.5(QF) JP7.4 LED6.A
T6B: JP8.4 R123.2
T7: IC8.6(QG) JP7.5 LED7.A
T7B: JP8.5 R118.2 R126.2 R146.2 R163.2
T8: IC8.7(QH) JP7.8
T8B: JP8.8
T9: JP7.9 U$1.20/A6(20/A6/PWM)
T9B: JP8.3 JP8.9 R115.2 R143.2 R160.2
T10: JP7.10 U$1.21/A7(21/A7/PWM)
T10B: JP8.10
TOMSLEVA: TOMLEV.1(A)
TOMSLEVB: C83.- C84.- R178.2
WNOISE: C40.- C80.2 IC6.8(C:OUT) R81.1 R180.1 R181.2
Unconnected: DINSYNC.4 DINSYNC.5 EDIT.LED1 EDIT.LED2 IC8.9(QH*) J1.2 J2.VCC LEFT.LED1 LEFT.LED2 MENU1.LED1 MENU1.LED2 MENU2.LED1 MENU2.LED2 MENU.LED1 MENU.LED2 MIDIIN.1 MIDIIN.2 MIDIIN.3 MIDIOUT.1 MIDIOUT.3 OK1.7(VB) PLAY.LED1 PLAY.LED2 RIGHT.LED1 RIGHT.LED2 SELECT.LED1 SELECT.LED2 U$1.9(9/RX2/PWM) U$8.P$3(FNC_3) U$8.P$7(D0_7) U$8.P$8(D1_8) U$8.P$9(D2_9) U$8.P$10(D3_10) U$13.E(C) VOLUME.1(A) VOLUME.2(S) VOLUME.3(E)

## Notes on the sheet
- check this, might be in series
- maybe patch in noise here too
- 12VAC

## Power pins joined to a net without a drawn wire
PE: DINSYNC.PE DINSYNC.PE@(PE) MIDIIN.PE MIDIIN.PE@(PE) MIDIOUT.PE MIDIOUT.PE@(PE)

## Library data of the parts
BASSACCENT BASSDECAY BASSLEVEL BASSTONE BASSTUNE CHDECAY HATFILTER HATSLEVEL HATSLEVEL1 HTOMTUN LTOMDEC LTOMTUN OHDECAY1 R25 SNAPPY SNLEVEL SNTONE TOMLEV VOLUME = dan:US-EVU: 9 mm Square Rotary Potentiometers Source: Panasonic
C1-C7 C14-C19 C22-C24 C29-C38 C47-C57 C59 C61 C64 C65 C68-C70 C72-C77 C79-C82 = dan:C-US: CAPACITOR, American symbol
C8-C13 C20 C21 C25-C28 C39-C46 C58 C60 C62 C63 C66 C67 C71 C78 C83-C85 = dan:CPOL-US: POLARIZED CAPACITOR, American symbol
D1 D8-D11 D13-D18 = dan:1N4148: DIODE high speed (Philips)
D2-D7 D12 = dan:1N4004: DIODE general purpose rectifier, 1 A
D+ D- = synthdiy:2,0/0,9-R: ROUND THROUGH-HOLE PAD 2.0 mm, 0.9 mm/0.079",0.035"
DINSYNC MIDIIN MIDIOUT = dan:MAB5SH: Female CONNECTOR 5 pins 90 deg. with shield, horizontal (DIN 41524); OC_FARNELL: 809883; OC_NEWARK: unknown
EDIT LEFT MENU MENU1 MENU2 PLAY RIGHT SELECT = dan:CHERRY-MX-LED: Cherry MX series keyswitch with LED
IC1 = dan:4051: 8-channel ANALOG MULTIPLEXER
IC2 = dan:4584: Hex SCHMITT TRIGGER (74C14)
IC3 = dan:78*: Positive VOLTAGE REGULATOR Source: http://cache.national.com/ds/LM/LM78L05.pdf http://www.fairchildsemi.com/ds/LM/LM7805.pdf
IC4 = dan:79*: Negative VOLTAGE REGULATOR
IC5 IC10 = dan:OPA2134: SoundPLUS (TM) High Performance AUDIO OPERATIONAL AMPLIFIERS Source: http://focus.ti.com/lit/ds/sbos058/sbos058.pdf
IC6 IC9 = dan:OPA4130: Low Power, Precision FET-Input Operational Amplifiers; OC_FARNELL: unknown; OC_NEWARK: unknown
IC7 = dan:LM2574?-*: SIMPLE SWITCHER 0.5A Step-Down Voltage Regulator Source: http://cache.national.com/ds/LM/LM2574.pdf
IC8 = dan:74*595: 8-bit SHIFT REGISTER, output latch
J1 = dan:JACK-PLUG: DC POWER JACK Power Jack, DC, Right Angle, Through Hole, Rated 5A at 16VDC, PC Terminals Distributor: Farnell (www.Farnell.de) Drawing: 84N1161.pdf / 84N1162.pdf Manufacturer: SPC Technology (www.spctechnology.com) Type: SPC4077 / SPC 4078; OC_FARNELL: unknown; OC_NEWARK: unknown
J2 = UBBS-4R-D14-4D:UBBS-4R-D14-4D: Socket; USB B; on PCBs; THT; PIN: 4; straight; V: USB 2.0; AVAILABILITY: Unavailable; DESCRIPTION: Socket; USB B; on PCBs; THT; PIN: 4; straight; V: USB 2.0; MF: JST; MP: UBBS-4R-D14-4D; PACKAGE: None; PRICE: None
JP1-JP8 = dan:PINHD-2X6: PIN HEADER
LED1-LED7 = dan:LED: LED OSRAM: - CHIPLED LG R971, LG N971, LY N971, LG Q971, LY Q971, LO R971, LY R971 LH N974, LH R974 LS Q976, LO Q976, LY Q976 LO Q996 - Hyper CHIPLED LW Q18S LB Q993, LB Q99A, LB R99A - SideLED LS A670, LO A670, LY A670, LG A670, LP A670 LB A673, LV A673, LT A673, LW A673 LH A674 LY A675 LS A676, LA A676, LO A676, LY A676, LW A676 LS A679, LY A679, LG A679 - Hyper Micro SIDELED® LS Y876, LA Y876, LO Y876, LY Y876 LT Y87S - SmartLED LW L88C, LW L88S LB L89C, LB L89S, LG L890 LS L89K, LO L89K, LY L89K LS L896, LA L896, LO L896, LY L896 - TOPLED LS T670, LO T670, LY T670, LG T670, LP T670 LSG T670, LSP T670, LSY T670, LOP T670, LYG T670 LG T671, LOG T671, LSG T671 LB T673, LV T673, LT T673, LW T673 LH T674 LS T676, LA T676, LO T676, LY T676, LB T676, LH T676, LSB T676, LW T676 LB T67C, LV T67C, LT T67C, LS T67K, LO T67K, LY T67K, LW E67C LS E67B, LA E67B, LO E67B, LY E67B, LB E67C, LV E67C, LT E67C LW T67C LS T679, LY T679, LG T679 LS T770, LO T770, LY T770, LG T770, LP T770 LB T773, LV T773, LT T773, LW T773 LH T774 LS E675, LA E675, LY E675, LS T675 LS T776, LA T776, LO T776, LY T776, LB T776 LHGB T686 LT T68C, LB T68C - Hyper Mini TOPLED® LB M676 - Mini TOPLED Santana® LG M470 LS M47K, LO M47K, LY M47K Source: http://www.osram.convergy.de LUXEON: - LUMILED® LXK2-PW12-R00, LXK2-PW12-S00, LXK2-PW14-U00, LXK2-PW14-V00 LXK2-PM12-R00, LXK2-PM12-S00, LXK2-PM14-U00 LXK2-PE12-Q00, LXK2-PE12-R00, LXK2-PE12-S00, LXK2-PE14-T00, LXK2-PE14-U00 LXK2-PB12-K00, LXK2-PB12-L00, LXK2-PB12-M00, LXK2-PB14-N00, LXK2-PB14-P00, LXK2-PB14-Q00 LXK2-PR12-L00, LXK2-PR12-M00, LXK2-PR14-Q00, LXK2-PR14-R00 LXK2-PD12-Q00, LXK2-PD12-R00, LXK2-PD12-S00 LXK2-PH12-R00, LXK2-PH12-S00 LXK2-PL12-P00, LXK2-PL12-Q00, LXK2-PL12-R00 Source: www.luxeon.com KINGBRIGHT: KA-3528ASYC Source: www.kingbright.com
OK1 = dan:6N138: MOTOROLA OPTO COUPLER; MF: VISHAY/TELEFUNKEN; MPN: 6N138; OC_FARNELL: 9860150; OC_NEWARK: 35K5294
R1-R24 R26-R186 = dan:R-US_: RESISTOR, American symbol
U$1 = Teensy_3_and_LC_Series_Boards_v1.4:TEENSY_3.1-3.2_DIL: Teensy 3.1 or 3.2 in a DIL Layout.
U$2 U$4-U$7 U$10-U$14 U$16 U$18-U$22 U$24-U$26 U$29-U$32 = dan:2N3904_
U$3 U$9 U$15 U$17 U$23 U$27 U$28 = dan:2N3906_
U$8 = dan:CU20045-UW